# EasyEDA Pro project UCC-隔离半桥模块高压开窗.eprj

# Schematic Schematic1_8
Board Name: UCC-隔离半桥模块高压开窗; Create Date: 2026-01-26; Page Name: P1; Project Name: UCC-隔离半桥模块高压开窗; Schematic Name: Schematic1_8; Update Date: 2026-01-26; Company: Werner; Page Size: A4; Version: V1.0
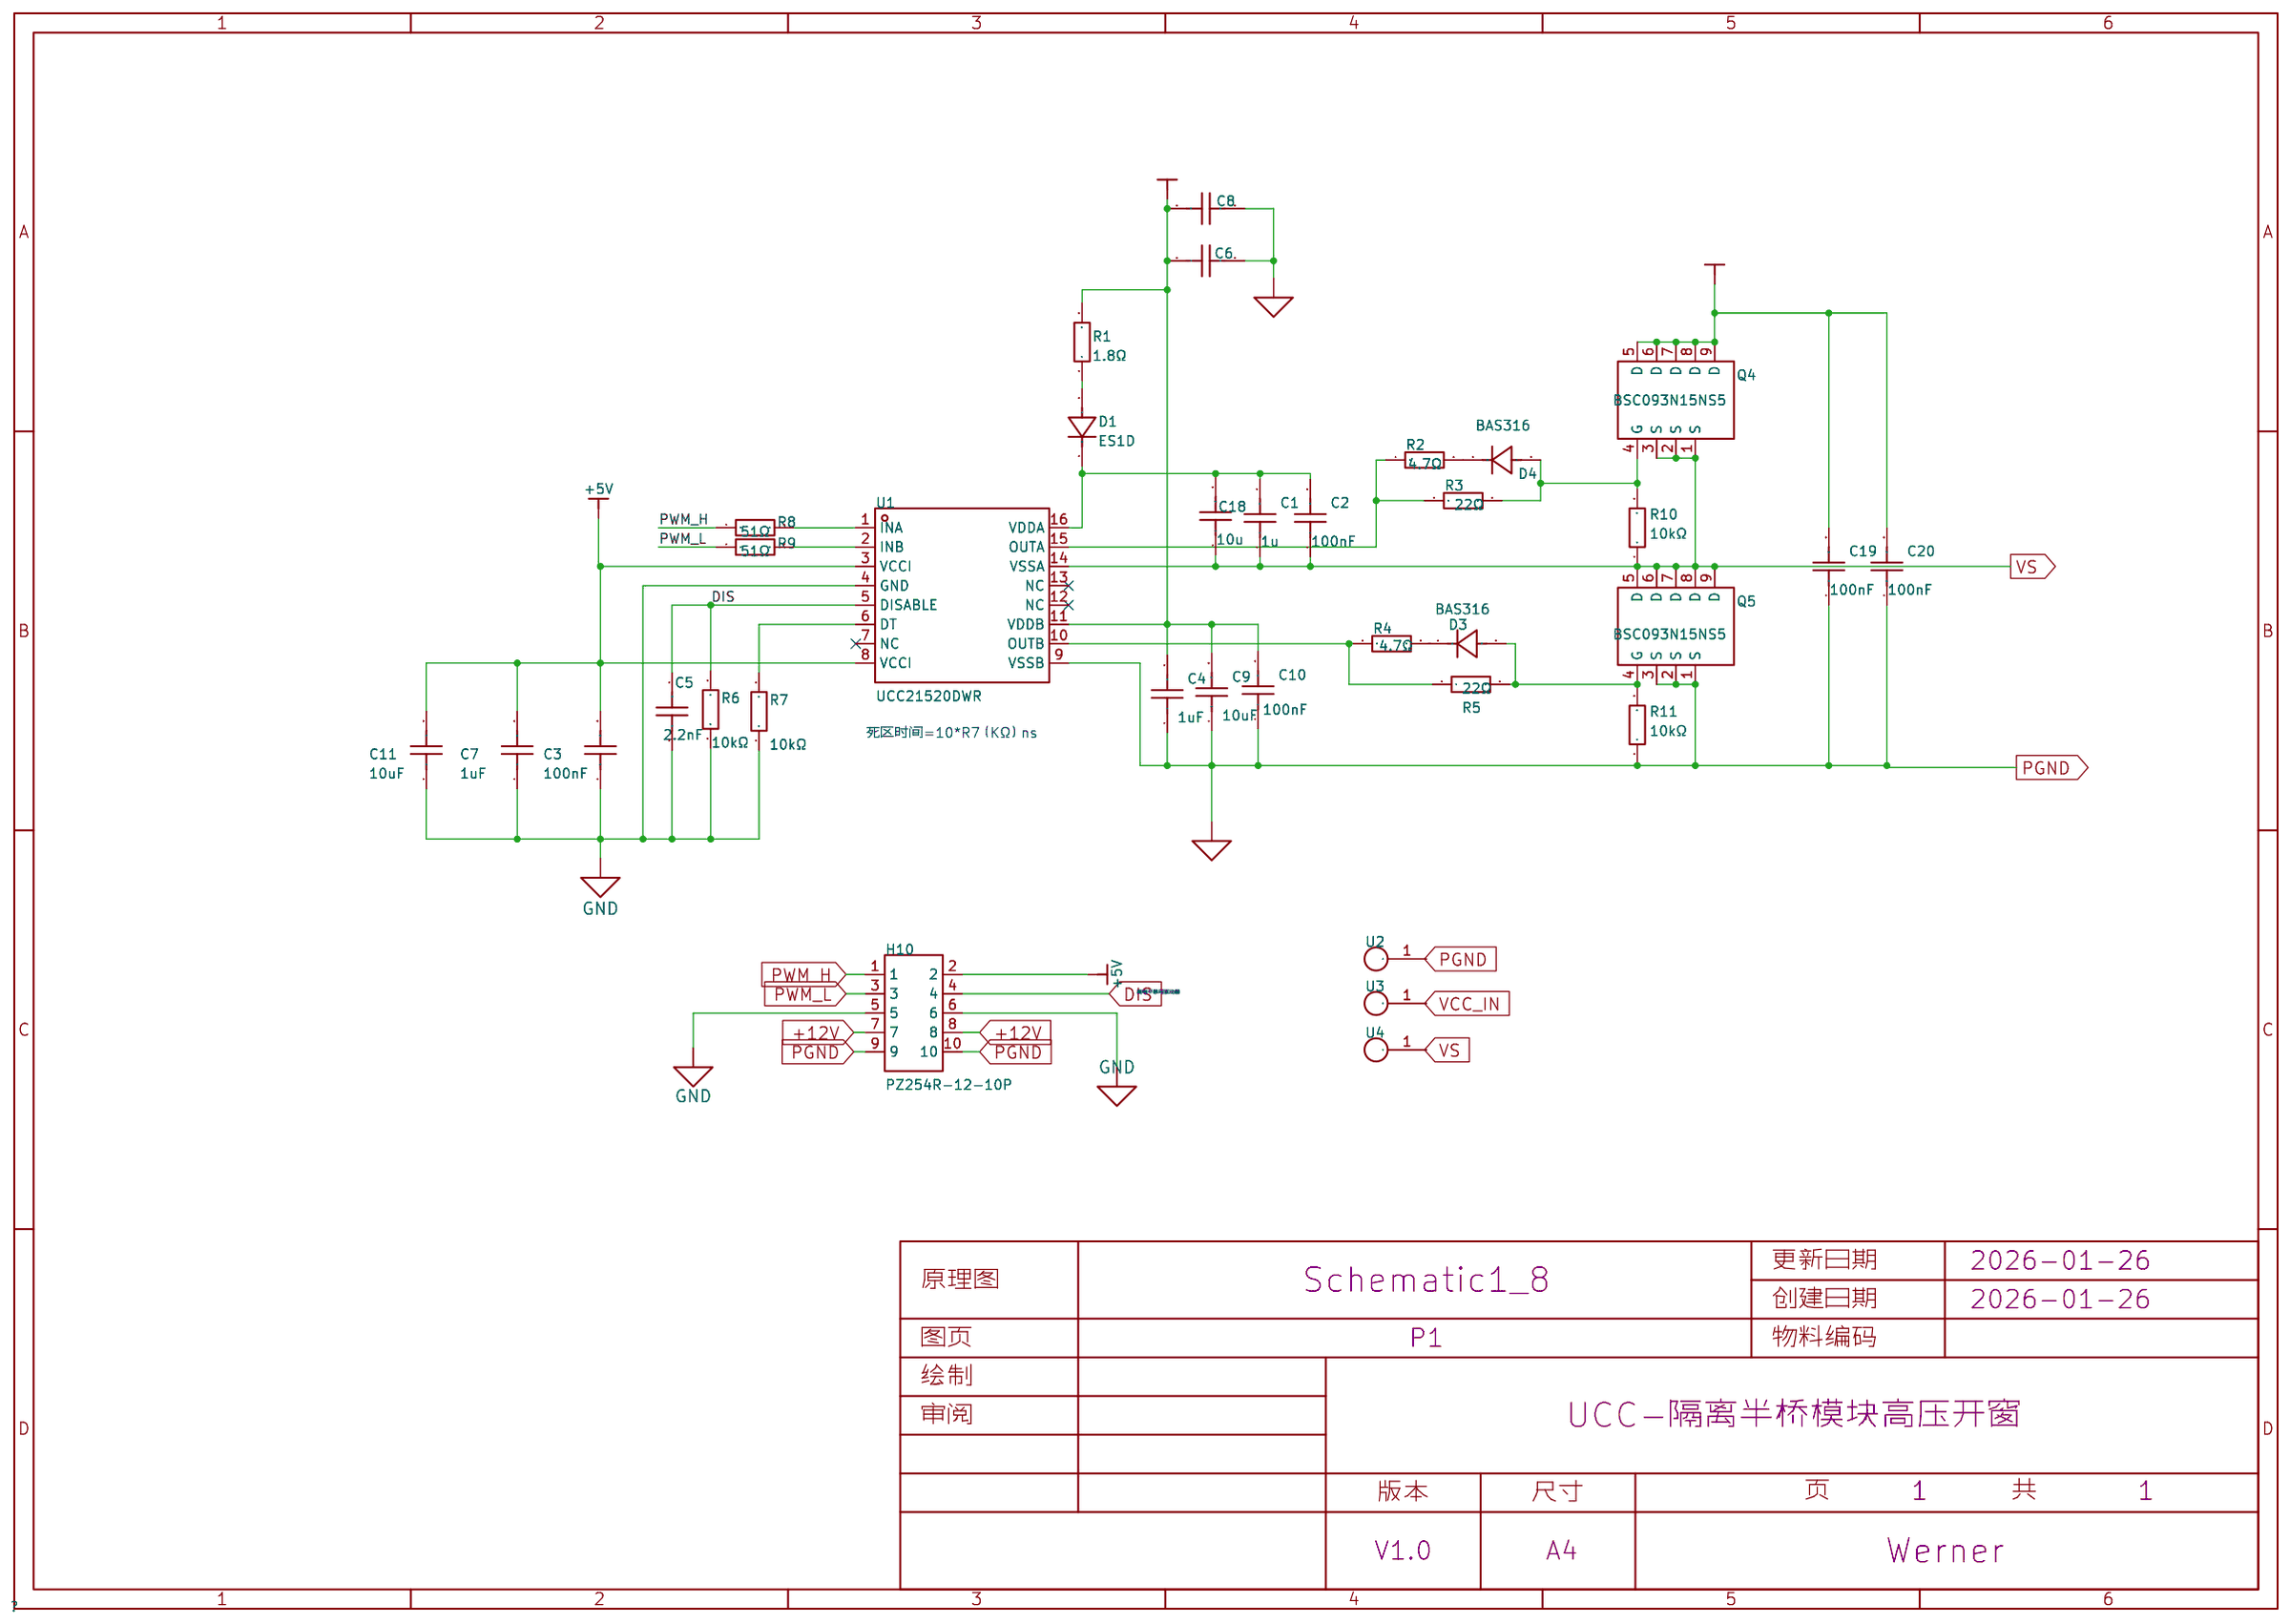
[diagram p0: schematic sheet]

## Parts
C1  1u  [C0603]
C2  100nF  [C0603]
C3  100nF  [C0603]
C4  1uF  [C0603]
C5  2.2nF  [C0603]
C6  1uF  [C0603]
C7  1uF  [C0603]
C8  10uF  [C0603]
C9  10uF  [C0603]
C10  100nF  [C0603]
C11  10uF  [C0603]
C18  10u  [C0603]
C19  100nF  [C1206_1]
C20  100nF  [C1206_1]
D1  ES1D  [SMA_L4.3-W2.6-LS5.0-RD]
D3  BAS316  [SOD-323_L1.7-W1.3-LS2.6-RD-1]
D4  BAS316  [SOD-323_L1.7-W1.3-LS2.6-RD-1]
H10  PZ254R-12-10P  [HDR-TH_10P-P2.54-H-M-R2-C5-S2.54]
Q4  BSC093N15NS5  [PG-TDSON-8_L5.0-W6.0-P1.27-LS6.2-BL-EP]
Q5  BSC093N15NS5  [PG-TDSON-8_L5.0-W6.0-P1.27-LS6.2-BL-EP]
R1  1.8Ω  [R0603]
R2  4.7Ω  [R0603]
R3  22Ω  [R0603]
R4  4.7Ω  [R0603]
R5  22Ω  [R0603]
R6  10kΩ  [R0603]
R7  10kΩ  [R0603]
R8  51Ω  [R0603]
R9  51Ω  [R0603]
R10  10kΩ  [R0603]
R11  10kΩ  [R0603]
U1  UCC21520DWR  [SOIC-16_L10.3-W7.5-P1.27-LS10.3-BL]
U2  -  [3.5mm香蕉头]
U3  -  [3.5mm香蕉头]
U4  -  [3.5mm香蕉头]

## Library data of the parts
C1 C2 C18-C20 = CAP_0805: Supplier Footprint: 0805; Check: false
C3 C10 = CC0603KRX7R9BB104: LCSC Part Name: 100nF ±10% 50V; Supplier Part: C14663; Manufacturer: YAGEO(国巨); Supplier Footprint: 0603; JLCPCB Part Class: Basic Part; Datasheet: https://item.szlcsc.com/datasheet/CC0603KRX7R9BB104/15331.html; Supplier: LCSC; Tolerance: ±10%; Voltage Rating: 50V; Temperature Coefficient: X7R
C4 C7 = CL10A105KB8NNNC: LCSC Part Name: 1uF ±10% 50V; Supplier Part: C15849; Manufacturer: SAMSUNG(三星); Supplier Footprint: 0603; JLCPCB Part Class: Basic Part; Datasheet: https://item.szlcsc.com/datasheet/CL10A105KB8NNNC/16531.html; Supplier: LCSC; Tolerance: ±10%; Voltage Rating: 50V; Temperature Coefficient: X5R
C5 = CL10B102KB8NNNC: LCSC Part Name: 1nF ±10% 50V; Supplier Part: C1588; Manufacturer: SAMSUNG(三星); Supplier Footprint: 0603; JLCPCB Part Class: Basic Part; Datasheet: https://item.szlcsc.com/datasheet/CL10B102KB8NNNC/1940.html; Supplier: LCSC; Tolerance: ±10%; Voltage Rating: 50V; Temperature Coefficient: X7R
C6 = CL10A105KB8NNNC: 容值:1uF;精度:±10%;额定电压:50V;温度系数:X5R;; LCSC Part Name: 1uF ±10% 50V; Supplier Part: C15849; Manufacturer: SAMSUNG(三星); Supplier Footprint: 0603; JLCPCB Part Class: Basic Part; Datasheet: https://item.szlcsc.com/datasheet/CL10A105KB8NNNC/16531.html; Supplier: LCSC; Tolerance: ±10%; Voltage Rating: 50V; Temperature Coefficient: X5R
C8 = CL10A106KP8NNNC: 容值:10uF;精度:±10%;额定电压:10V;温度系数:X5R;; LCSC Part Name: 10uF ±10% 10V; Supplier Part: C19702; Manufacturer: SAMSUNG(三星); Supplier Footprint: 0603; JLCPCB Part Class: Basic Part; Datasheet: https://item.szlcsc.com/datasheet/CL10A106KP8NNNC/20411.html; Supplier: LCSC; Tolerance: ±10%; Voltage Rating: 10V; Temperature Coefficient: X5R
C9 C11 = CL10A106KP8NNNC: LCSC Part Name: 10uF ±10% 10V; Supplier Part: C19702; Manufacturer: SAMSUNG(三星); Supplier Footprint: 0603; JLCPCB Part Class: Basic Part; Datasheet: https://item.szlcsc.com/datasheet/CL10A106KP8NNNC/20411.html; Supplier: LCSC; Tolerance: ±10%; Voltage Rating: 10V; Temperature Coefficient: X5R
D1 = ES1D_C18199158: Supplier Part: C18199158; Manufacturer: 宏嘉诚; Supplier Footprint: SMA(DO-214AC); JLCPCB Part Class: 扩展库; Datasheet: https://atta.szlcsc.com/upload/public/pdf/source/20250205/B1E84D4445B9489CFA7F7BECE61A56D0.pdf; Supplier: LCSC; Diode Configuration: 独立式; Voltage - Forward(Vf@If): 1V@1A; Voltage - DC Reverse(Vr): 200V; Current - Rectified: 1A; Reverse Leakage Current (Ir): 2uA@200V; Operating Temperature: -55℃~+150℃
D3 D4 = BAS316_C7502720: Supplier Part: C7502720; Manufacturer: 宏迦橙; Supplier Footprint: SOD-323; JLCPCB Part Class: 扩展库; Datasheet: https://atta.szlcsc.com/upload/public/pdf/source/20230828/E4F144F1C01E47EFB641298D117ADC1E.pdf; Supplier: LCSC; Diode Configuration: 独立式; Forward Voltage (Vf@If): 1.25V@150mA; Reverse Voltage (Vr): 100V; Rectified Current: 250mA; Reverse Leakage Current (Ir): 1uA; Reverse Recovery Time (trr): 4ns; Operating Temperature: -55℃~+150℃
H10 = PZ254R-12-10P: LCSC Part Name: 2x5P 间距:2.54mm 方针 弯插; Supplier Part: C492433; Manufacturer: XFCN(兴飞); Supplier Footprint: 弯插,P=2.54mm; JLCPCB Part Class: 扩展库; Datasheet: https://item.szlcsc.com/datasheet/PZ254R-12-10P/502989.html; Supplier: LCSC; Pin Structure: 2x5P; Pitch: 2.54mm; Row Spacing: 2.54mm; Circluar Pins/Square Pins: 方针; Mounting Type: 弯插; Number of Rows: 双排; Number of Pins: 10P; Length of Mating Pin: 6mm; Insulation Height: 2.5mm; Contact Material: 黄铜; Operating Temperature: -40℃~+105℃; Color: 黑色
Q4 Q5 = BSC093N15NS5: LCSC Part Name: 1个N沟道 耐压:150V 电流:87A; Supplier Part: C454270; Manufacturer: Infineon(英飞凌); Supplier Footprint: TDSON-8(5x6); JLCPCB Part Class: 扩展库; Datasheet: https://item.szlcsc.com/datasheet/BSC093N15NS5/456361.html; Supplier: LCSC; Number: 1个N沟道; Drain to Source Voltage: 150V; Current - Continuous Drain(Id): 87A; RDS(on): 9.3mΩ@10V,44A; Pd - Power Dissipation: 139W; Gate Threshold Voltage (Vgs(th)): 4.6V; Gate Charge(Qg): 40.7nC@10V; Input Capacitance(Ciss): 3.23nF@75V; Reverse Transfer Capacitance (Crss@Vds): 26pF@75V; Operating Temperature: -55℃~+150℃
R1 = RC0805FR-072R2L: LCSC Part Name: 厚膜电阻 2.2Ω ±1% 125mW; Supplier Part: C137549; Manufacturer: YAGEO(国巨); Supplier Footprint: 0805; JLCPCB Part Class: Extended Part; Datasheet: https://atta.szlcsc.com/upload/public/pdf/source/20180821/C275644_0D56F95EFF785E7D9A1FEF436B37DA78.pdf; Supplier: LCSC; Type: 厚膜电阻; Tolerance: ±1%; Power(Watts): 125mW; Overload Voltage (Max): 150V; Temperature Coefficient: ±200ppm/℃; Operating Temperature Range: -55℃~+155℃
R2-R5 = Res_1206: Supplier Footprint: 1206
R6 R7 = RC0603FR-0710KL: LCSC Part Name: 厚膜电阻 10kΩ ±1% 100mW; Supplier Part: C98220; Manufacturer: YAGEO(国巨); Supplier Footprint: 0603; JLCPCB Part Class: Extended Part; Datasheet: https://atta.szlcsc.com/upload/public/pdf/source/20180927/C295883_E8D83085EA81BD7DE0B2B681138C15EE.pdf; Supplier: LCSC; Type: 厚膜电阻; Tolerance: ±1%; Power(Watts): 100mW; Overload Voltage (Max): 75V; Temperature Coefficient: ±100ppm/℃; Operating Temperature Range: -55℃~+155℃
R8 R9 = 0603WAF510JT5E: LCSC Part Name: 51Ω ±1% 100mW 厚膜电阻; Supplier Part: C23197; Manufacturer: UNI-ROYAL(厚声); Supplier Footprint: 0603; JLCPCB Part Class: Basic Part; Datasheet: https://item.szlcsc.com/datasheet/0603WAF510JT5E/23924.html; Supplier: LCSC; Type: 厚膜电阻; Tolerance: ±1%; Power(Watts): 100mW; Voltage-Supply(Max): 75V; Temperature Coefficient: ±100ppm/℃; Operating Temperature: -55℃~+155℃
R10 R11 = 0603WAF1002T5E: LCSC Part Name: 厚膜电阻 10kΩ ±1% 100mW; Supplier Part: C25804; Manufacturer: UNI-ROYAL(厚声); Supplier Footprint: 0603; JLCPCB Part Class: Basic Part; Datasheet: https://item.szlcsc.com/datasheet/0603WAF1002T5E/26547.html; Supplier: LCSC; Type: 厚膜电阻; Tolerance: ±1%; Power(Watts): 100mW; Voltage-Supply(Max): 75V; Temperature Coefficient: ±100ppm/℃; Operating Temperature: -55℃~+155℃
U1 = UCC21520DWR: Supplier Part: C601651; Manufacturer: TI(德州仪器); Supplier Footprint: SOIC-16; JLCPCB Part Class: Extended Part; Supplier: LCSC; NO_CONNECT: yes
U2-U4 = 3.5mm香蕉头

## Nets
+5V: C3.2 C7.2 C11.2 H10.2 U1.3(VCCI) U1.8(VCCI)
+12V: C4.2 C6.2 C8.2 C9.2 C10.2 H10.7 H10.8 R1.2 U1.11(VDDB)
GND: C3.1 C5.1 C7.1 C11.1 H10.5 H10.6 R6.2 R7.1 U1.4(GND)
PGND: C4.1 C6.1 C8.1 C9.1 C10.1 C19.1 C20.1 H10.9 H10.10 Q5.1(S) Q5.2(S) Q5.3(S) R11.1 U1.9(VSSB) U2.1
VCC_IN: C19.2 C20.2 Q4.5(D) Q4.6(D) Q4.7(D) Q4.8(D) Q4.9(D) U3.1
DIS: C5.2 H10.4 R6.1 U1.5(DISABLE)
PWM_H: H10.1 R8.1
PWM_L: H10.3 R9.1
VS: C1.1 C2.1 C18.1 Q4.1(S) Q4.2(S) Q4.3(S) Q5.5(D) Q5.6(D) Q5.7(D) Q5.8(D) Q5.9(D) R10.1 U1.14(VSSA) U4.1
$1N1229: R8.2 U1.1(INA)
$1N1230: R9.2 U1.2(INB)
$1N1232: R7.2 U1.6(DT)
$1N1235: C1.2 C2.2 C18.2 D1.1(K) U1.16(VDDA)
$1N1237: R2.1 R3.1 U1.15(OUTA)
$1N1261: R4.1 R5.1 U1.10(OUTB)
$1N14478: D4.1(K) R2.2
$1N14490: D3.1(K) R4.2
$1N14500: D3.2(A) Q5.4(G) R5.2 R11.2
$1N14505: D1.2(A) R1.1
$1N21237: D4.2(A) Q4.4(G) R3.2 R10.2

Not connected (* = marked no-connect by the designer): U1 7(NC)* 12(NC)* 13(NC)*

## Notes on the sheet
- 死区时间=10*R7（KΩ）ns
- 高电平禁用驱动器

# Board PCB1_8
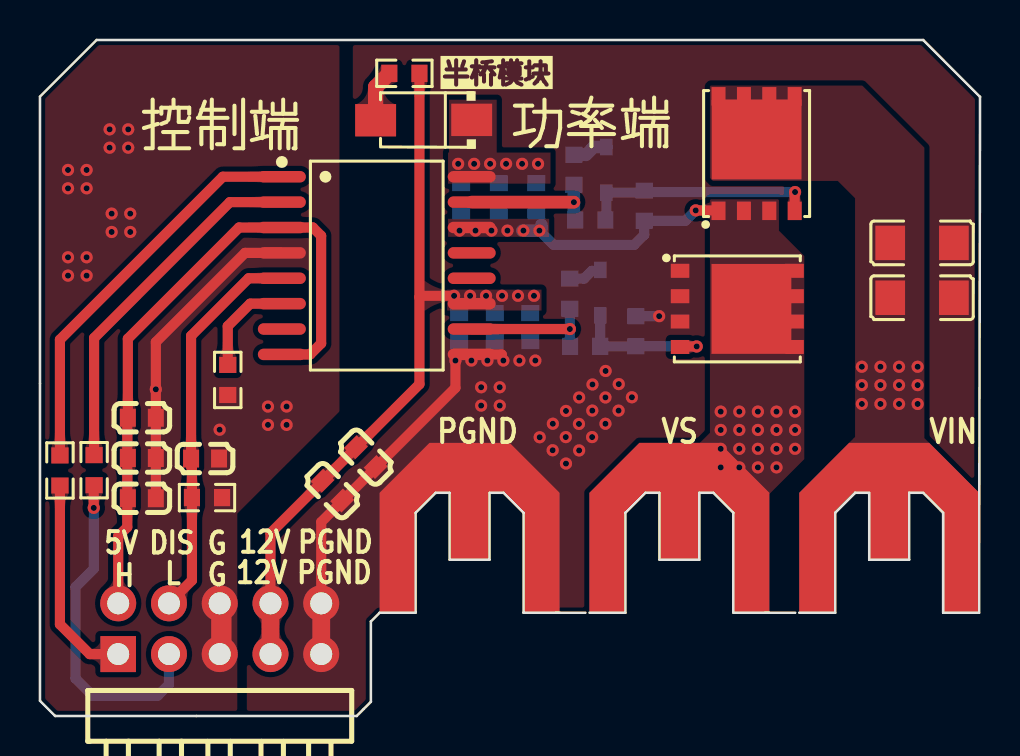
[diagram p1: board, top side]
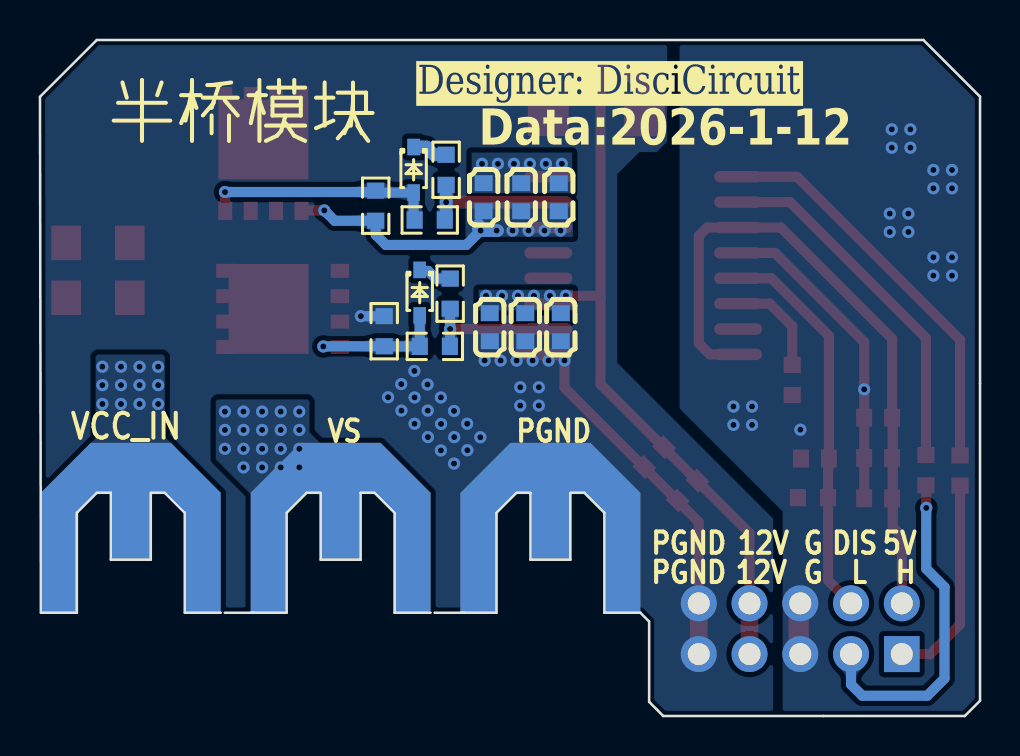
[diagram p2: board, bottom side, seen from below]

Outline 47.05 x 33.83 mm; copper layers: Top Layer, Bottom Layer. Coordinates in mm from the lower left corner of the outline.
Outline path: 17,5.17 16.56,4.73 16.56,0.71 16.2,0.36 15.85,0 0.76,0 0,0.76 0,30.99 2.84,33.83 44.2,33.83 47.05,30.98 47,5.17 ; 25.8,5.17 27.3,5.17 ; 36.3,5.17 37.8,5.17
Stack: Top Layer 0.035mm / SUBSTRATE1 1.51mm FR4 er 4.5 / Bottom Layer 0.035mm

## Design rules (mm)
spacing copperThickness1oz (default): track to track 0.102, other pairs 0.152 to 0.3
spacing copperThickness2oz: track to track 0.203, other pairs 0.152 to 0.3
spacing Plane_innerPlane: track to track 0.102, other pairs 0.152 to 0.3
spacing Copper_copperRegion: track to track 0.102, other pairs 0.152 to 0.3
track width copperThickness1oz (default): min 0.127, default 0.254, max 2.54
track width copperThickness2oz: min 0.203, default 0.254, max 2.54
differential pair differentialPair (default): width min 0.127, default 0.254, max 2.54; gap min 0.152, default 0.152
via viaSize (default): diameter min 0.5, default 0.61, max 10; hole min 0.3, default 0.305, max 6.3
net PGND uses copperRegion_copperThickness1oz
pour e27 uses Copper_copperRegion, copperRegion_Copper_copperRegion
pour e29 uses Copper_copperRegion, copperRegion_Copper_copperRegion
pour e292 uses Copper_copperRegion, copperRegion_Copper_copperRegion
pour e341 uses Copper_copperRegion, copperRegion_Copper_copperRegion

## Placement (name value [footprint] x y rotation side)
C1  1u  [C0603]  24.84 25.96 90 bottom
C2  100nF  [C0603]  22.96 25.96 90 bottom
C3  100nF  [C0603]  5.1 12.91 180 top
C4  1uF  [C0603]  20.98 19.46 90 bottom
C5  2.2nF  [C0603]  8.26 12.88 180 top
C6  1uF  [C0603]  16.31 12.95 135 top
C7  1uF  [C0603]  5.1 10.9 180 top
C8  10uF  [C0603]  14.63 11.28 135 top
C9  10uF  [C0603]  22.76 19.46 90 bottom
C10  100nF  [C0603]  24.54 19.46 90 bottom
C11  10uF  [C0603]  5.1 14.92 180 top
C18  10u  [C0603]  21.08 25.96 90 bottom
C19  100nF  [C1206_1]  44.15 20.93 180 top
C20  100nF  [C1206_1]  44.15 23.67 180 top
D1  ES1D  [SMA_L4.3-W2.6-LS5.0-RD]  19.2 29.82 180 top
D3  BAS316  [SOD-323_L1.7-W1.3-LS2.6-RD-1]  28.04 21.18 270 bottom
D4  BAS316  [SOD-323_L1.7-W1.3-LS2.6-RD-1]  28.35 27.33 270 bottom
H10  PZ254R-12-10P  [HDR-TH_10P-P2.54-H-M-R2-C5-S2.54]  9 4.37 0 top
Q4  BSC093N15NS5  [PG-TDSON-8_L5.0-W6.0-P1.27-LS6.2-BL-EP]  35.87 28.14 0 top
Q5  BSC093N15NS5  [PG-TDSON-8_L5.0-W6.0-P1.27-LS6.2-BL-EP]  34.9 20.37 270 top
R1  1.8Ω  [R0603]  18.24 32.16 0 top
R2  4.7Ω  [R0603]  26.72 27.33 90 bottom
R3  22Ω  [R0603]  27.54 24.82 0 bottom
R4  4.7Ω  [R0603]  26.52 21.13 90 bottom
R5  22Ω  [R0603]  27.28 18.5 0 bottom
R6  10kΩ  [R0603]  8.36 10.93 0 top
R7  10kΩ  [R0603]  9.4 16.81 90 top
R8  51Ω  [R0603]  1 12.29 90 top
R9  51Ω  [R0603]  2.71 12.3 90 top
R10  10kΩ  [R0603]  30.24 25.53 90 bottom
R11  10kΩ  [R0603]  29.82 19.25 270 bottom
U1  UCC21520DWR  [SOIC-16_L10.3-W7.5-P1.27-LS10.3-BL]  16.86 22.54 270 top
U2  -  [3.5mm香蕉头]  21.5 9.17 0 top
U3  -  [3.5mm香蕉头]  42.5 9.17 0 top
U4  -  [3.5mm香蕉头]  32 9.17 0 top

## Footprints (pads in the part's own frame, mm; a bottom-side part is the same pattern mirrored in y, then rotated)
3.5mm香蕉头
  custom 9x8.5 smd: 1(0,1.585)
  custom 9x8.5 smd far side: 1(0,1.585)
C0603
  rect 0.8x0.9 smd: 1(-0.7,0) 2(0.7,0)
C1206_1
  rect 1.485x1.728 smd: 1(-1.593,0) 2(1.593,0)
HDR-TH_10P-P2.54-H-M-R2-C5-S2.54
  rect 1.778x1.8 hole 1.1: 1(-5.08,-1.27)
  round 1.8 hole 1.1: 2(-5.08,1.27) 3(-2.54,-1.27) 4(-2.54,1.27) 5(0,-1.27) 6(0,1.27) 7(2.54,-1.27) 8(2.54,1.27) 9(5.08,-1.27) 10(5.08,1.27)
PG-TDSON-8_L5.0-W6.0-P1.27-LS6.2-BL-EP
  rect 0.7x0.925 smd: 1(-1.905,-2.865) 2(-0.635,-2.865) 3(0.635,-2.865) 4(1.905,-2.865) 5(1.905,2.865) 6(0.635,2.865) 7(-0.635,2.865) 8(-1.905,2.865)
  rect 4.5x4 smd: 9(0.001,0.705)
R0603
  rect 0.806x0.864 smd: 1(-0.753,0) 2(0.753,0)
SMA_L4.3-W2.6-LS5.0-RD
  rect 2.046x1.62 smd: 1(-2.404,-0.009) 2(2.404,0.009)
SOD-323_L1.7-W1.3-LS2.6-RD-1
  rect 0.83x0.63 smd: 1(-1.14,0) 2(1.14,0)
SOIC-16_L10.3-W7.5-P1.27-LS10.3-BL
  oval 0.574x2.401 smd: 1(-4.445,-4.75) 2(-3.175,-4.75) 3(-1.905,-4.75) 4(-0.635,-4.75) 5(0.635,-4.75) 6(1.905,-4.75) 7(3.175,-4.75) 8(4.445,-4.75) 9(4.445,4.75) 10(3.175,4.75) 11(1.905,4.75) 12(0.635,4.75) 13(-0.635,4.75) 14(-1.905,4.75) 15(-3.175,4.75) 16(-4.445,4.75)

## Nets
As in the schematic.

Pads without a net: U1 7 12 13

## Via types
v1: diameter 0.61, hole 0.305, Top Layer to Bottom Layer, 106 vias

## Routing (per net, layer and track width the routed paths; a pad name or vN(x,y) marks a point on that pad's centre or on a via; arc(x,y) is an arc through that point)
+5V: length 33.2
  Top Layer w0.508: U1.8 13.52,18.09 14.07,18.64 14.07,24.03 13.66,24.44 U1.3 9.97,24.44 4.4,18.88 C11.2 4.37,14.9 4.37,9.45 3.92,9 H10.2
+12V: length 33.9
  Top Layer w0.508: H10.8 11.54,9.15 18.99,16.6 18.99,20.96 ; 18.99,20.96 19.06,21.03 v1(20.73,21.03) ; 18.99,20.96 R1.2
  Top Layer w0.889: H10.7 H10.8
  vias: v1(21.53,21.03) v1(22.32,21.03) v1(23.12,21.03) v1(23.92,21.03) v1(24.72,21.03)
GND: length 18.6
  Top Layer w0.508: U1.4 10.26,23.17 5.8,18.71 v1(5.8,16.35) C11.1 C3.1 C7.1 ; v1(3.59,25.14) 3.56,25.14
  Top Layer w1.016: H10.6 9.08,5.56 9.08,3.18 H10.5
  vias: v1(1.4,27.32) v1(1.4,26.4) v1(1.4,22.95) v1(1.4,22.04) v1(2.33,27.32) v1(2.33,26.4) v1(2.33,22.95) v1(2.33,22.04) v1(3.49,29.35) v1(3.49,28.44) v1(3.59,24.22) v1(4.42,29.35) v1(4.42,28.44) v1(4.52,25.14) v1(4.52,24.22) v1(8.99,14.33) v1(11.41,15.49) v1(11.41,14.57) v1(12.34,15.49) v1(12.34,14.57)
PGND: length 20.1
  Top Layer w0.508: v1(20.79,17.79) 20.79,16.42 14.08,9.71 H10.10 ; U1.9 23.11,18.09 23.11,18.08
  Top Layer w0.889: H10.9 H10.10
  Bottom Layer w0.508: R11.1 v1(30.99,20.01)
  vias: v1(21.59,17.79) v1(22.08,16.45) v1(22.08,15.53) v1(22.39,17.79) v1(23.01,16.45) v1(23.01,15.53) v1(23.19,17.79) v1(23.99,17.79) v1(24.79,17.79) v1(25.01,13.95) v1(25.67,14.62) v1(25.66,13.3) v1(26.32,15.26) v1(26.32,13.96) v1(26.32,12.63) v1(26.98,15.94) v1(26.97,14.61) v1(26.98,13.29) v1(27.64,15.28) v1(27.63,13.96) v1(27.65,16.59) v1(28.31,17.27) v1(28.3,15.94) v1(28.3,14.62) v1(28.97,16.61) v1(28.96,15.28) v1(29.62,15.95)
VCC_IN:
  vias: v1(41.13,17.48) v1(41.13,16.56) v1(41.13,15.61) v1(42.06,17.48) v1(42.06,16.56) v1(42.06,15.61) v1(42.99,17.48) v1(42.99,16.56) v1(42.99,15.61) v1(43.92,17.48) v1(43.92,16.56) v1(43.92,15.61)
DIS: length 19.6
  Top Layer w0.508: U1.5 10.44,21.9 7.56,19.02 7.56,12.48 7.61,12.43 7.61,6.79 H10.4
PWM_H: length 10.5
  Top Layer w0.508: R8.1 1,4.59 2.49,3.1 H10.1
PWM_L: length 16.8
  Top Layer w0.508: 2.71,11.55 2.69,11.53 v1(2.69,10.41)
  Bottom Layer w0.508: H10.3 6.46,1.58 5.89,1.02 2.64,1.02 1.78,1.88 1.78,6.45 2.69,7.37 v1(2.69,10.41)
VS: length 11.6
  Top Layer w0.508: v1(32.82,25.3) 33.99,25.3 34.01,25.28
  Bottom Layer w0.508: v1(32.82,25.3) 32.3,24.78 R10.1 30.24,24.08 29.74,23.57 25.71,23.57 v1(24.99,24.29)
  Bottom Layer w0.635: 24.14,24.29 v1(24.99,24.29) 25.1,24.39 25.1,24.57
  vias: v1(21,24.29) v1(21.8,24.29) v1(22.6,24.29) v1(23.4,24.29) v1(24.19,24.29) v1(34.07,15.23) v1(34.07,14.31) v1(34.07,13.37) v1(34.07,12.44) v1(35,15.23) v1(35,14.31) v1(35,13.37) v1(35,12.44) v1(35.93,15.23) v1(35.93,14.31) v1(35.93,13.37) v1(35.93,12.44) v1(36.86,15.23) v1(36.86,14.31) v1(36.86,13.37) v1(36.86,12.44) v1(37.79,15.23) v1(37.79,14.31) v1(37.79,13.37)
$1N1229: length 20.3
  Top Layer w0.508: U1.1 9.15,26.98 1,18.83 1,13.04
$1N1230: length 18.1
  Top Layer w0.508: U1.2 9.51,25.71 2.71,18.91 R9.2
$1N1232: length 5.1
  Top Layer w0.508: U1.6 10.52,20.63 9.4,19.51 R7.2
$1N1235:
  vias: v1(20.93,27.63) v1(21.73,27.63) v1(22.53,27.63) v1(23.33,27.63) v1(24.13,27.63) v1(24.93,27.63)
$1N1237: length 6.9
  Top Layer w0.635: U1.15 26.72,25.71
  Bottom Layer w0.508: 26.72,24.89 R3.1
  Bottom Layer w0.635: 26.72,24.89 v1(26.72,25.71) R2.1
$1N1261: length 6.8
  Top Layer w0.508: U1.10 v1(26.52,19.36)
  Bottom Layer w0.508: R4.1 26.52,20.38 v1(26.52,19.36) 26.52,18.51 R5.1
$1N14478: length 1.8
  Bottom Layer w0.635: D4.1 27.71,28.47 27.32,28.08 R2.2
$1N14490: length 1.7
  Bottom Layer w0.508: R4.2 27.24,21.89 27.62,22.27 27.99,22.27 D3.1
$1N14500: length 7.2
  Top Layer w0.508: v1(32.87,18.49) 32.06,18.49 Q5.4
  Bottom Layer w0.508: D3.2 28.04,20.04 R5.2 29.82,18.5 R11.2 32.86,18.5 v1(32.87,18.49)
$1N14505: length 2.6
  Top Layer w0.762: R1.1 16.8,31.47 D1.2
$1N21237: length 11.9
  Top Layer w0.508: v1(37.79,26.22) 37.77,26.2 37.77,25.28
  Bottom Layer w0.508: v1(37.79,26.22) 30.31,26.22 R10.2 30.15,26.19 D4.2 28.35,24.87 R3.2

## Copper pours and planes (outline as drawn; the poured copper is in the pictures)
+12V on Top Layer: 20.38,21.34 25.1,21.34 25.1,20.29 20.38,20.29
+12V on Bottom Layer: 20.38,21.34 25.1,21.34 25.1,20.29 20.38,20.29
GND on Top Layer: 1.42,-1.83 -1.27,0.87 -1.27,34.24 2.28,37.8 12.39,37.8 14.99,35.2 14.99,15.24 9.88,10.13 9.88,-0.51 8.56,-1.83
GND on Bottom Layer: 1.42,-1.83 -1.27,0.87 -1.27,34.24 2.28,37.8 12.39,37.8 15.04,35.15 15.04,15.39 9.88,10.23 9.88,-0.51 8.56,-1.83
PGND on Top Layer: 20.38,18.53 25.13,18.53 25.13,17.48 20.38,17.48
PGND on Top Layer: 23.27,22.92 32.56,22.92 32.56,10.77 23.27,10.77
PGND on Top Layer: 10.35,-1.8 10.35,9.88 18.16,17.68 18.16,27.11 17.05,28.22 16.19,28.22 15.66,28.75 15.66,34.15 16.06,34.56 47.43,34.56 48.25,33.75 48.25,-2.26 46.82,-3.69 12.24,-3.69
PGND on Bottom Layer: 20.38,18.53 25.14,18.53 25.14,17.48 20.38,17.48
PGND on Bottom Layer: 10.35,-1.8 10.35,9.88 18.16,17.68 18.16,27.11 17.05,28.22 16.19,28.22 15.66,28.75 15.66,34.2 16.01,34.56 47.43,34.56 48.25,33.75 48.25,-2.26 46.82,-3.69 12.24,-3.69
VCC_IN on Top Layer: 33.53,31.55 46.23,31.55 46.23,11.83 33.53,11.83
VCC_IN on Bottom Layer: 40.24,18.09 44.97,18.09 44.97,13.19 40.24,13.19
VS on Top Layer: 20.42,24.88 25.48,24.88 25.48,23.98 20.42,23.98
VS on Top Layer: 33.02,25.86 38.25,25.86 38.25,10.97 33.02,10.97
VS on Bottom Layer: 32.81,15.84 38.25,15.84 38.25,10.97 32.81,10.97
VS on Bottom Layer: 20.37,25.71 25.76,25.71 25.76,23.98 20.37,23.98
$1N1235 on Top Layer: 20.42,28.19 25.55,28.19 25.55,26.64 20.42,26.64
$1N1235 on Top Layer: 20.47,30.84 22.86,30.84 22.86,26.67 20.47,26.67
$1N1235 on Bottom Layer: 20.41,28.19 25.45,28.19 25.45,26.17 20.41,26.17

Small or netless copper shapes (teardrops, artwork), in the pictures only: 64 on Top Layer, 28 on Bottom Layer

## Text on the board
Bottom Silkscreen Layer: H | 5V | L | DIS | G | 12V | PGND | VS | VCC_IN | Data:2026-1-12 | Designer: DisciCircuit | 半桥模块
Top Silkscreen Layer: 5V | H | DIS | L | G | 12V | PGND | VS | VIN | 半桥模块 | 控制端 | 功率端
